# Altium project ESP-MONITOR.PrjPCB (part 1 of 2)
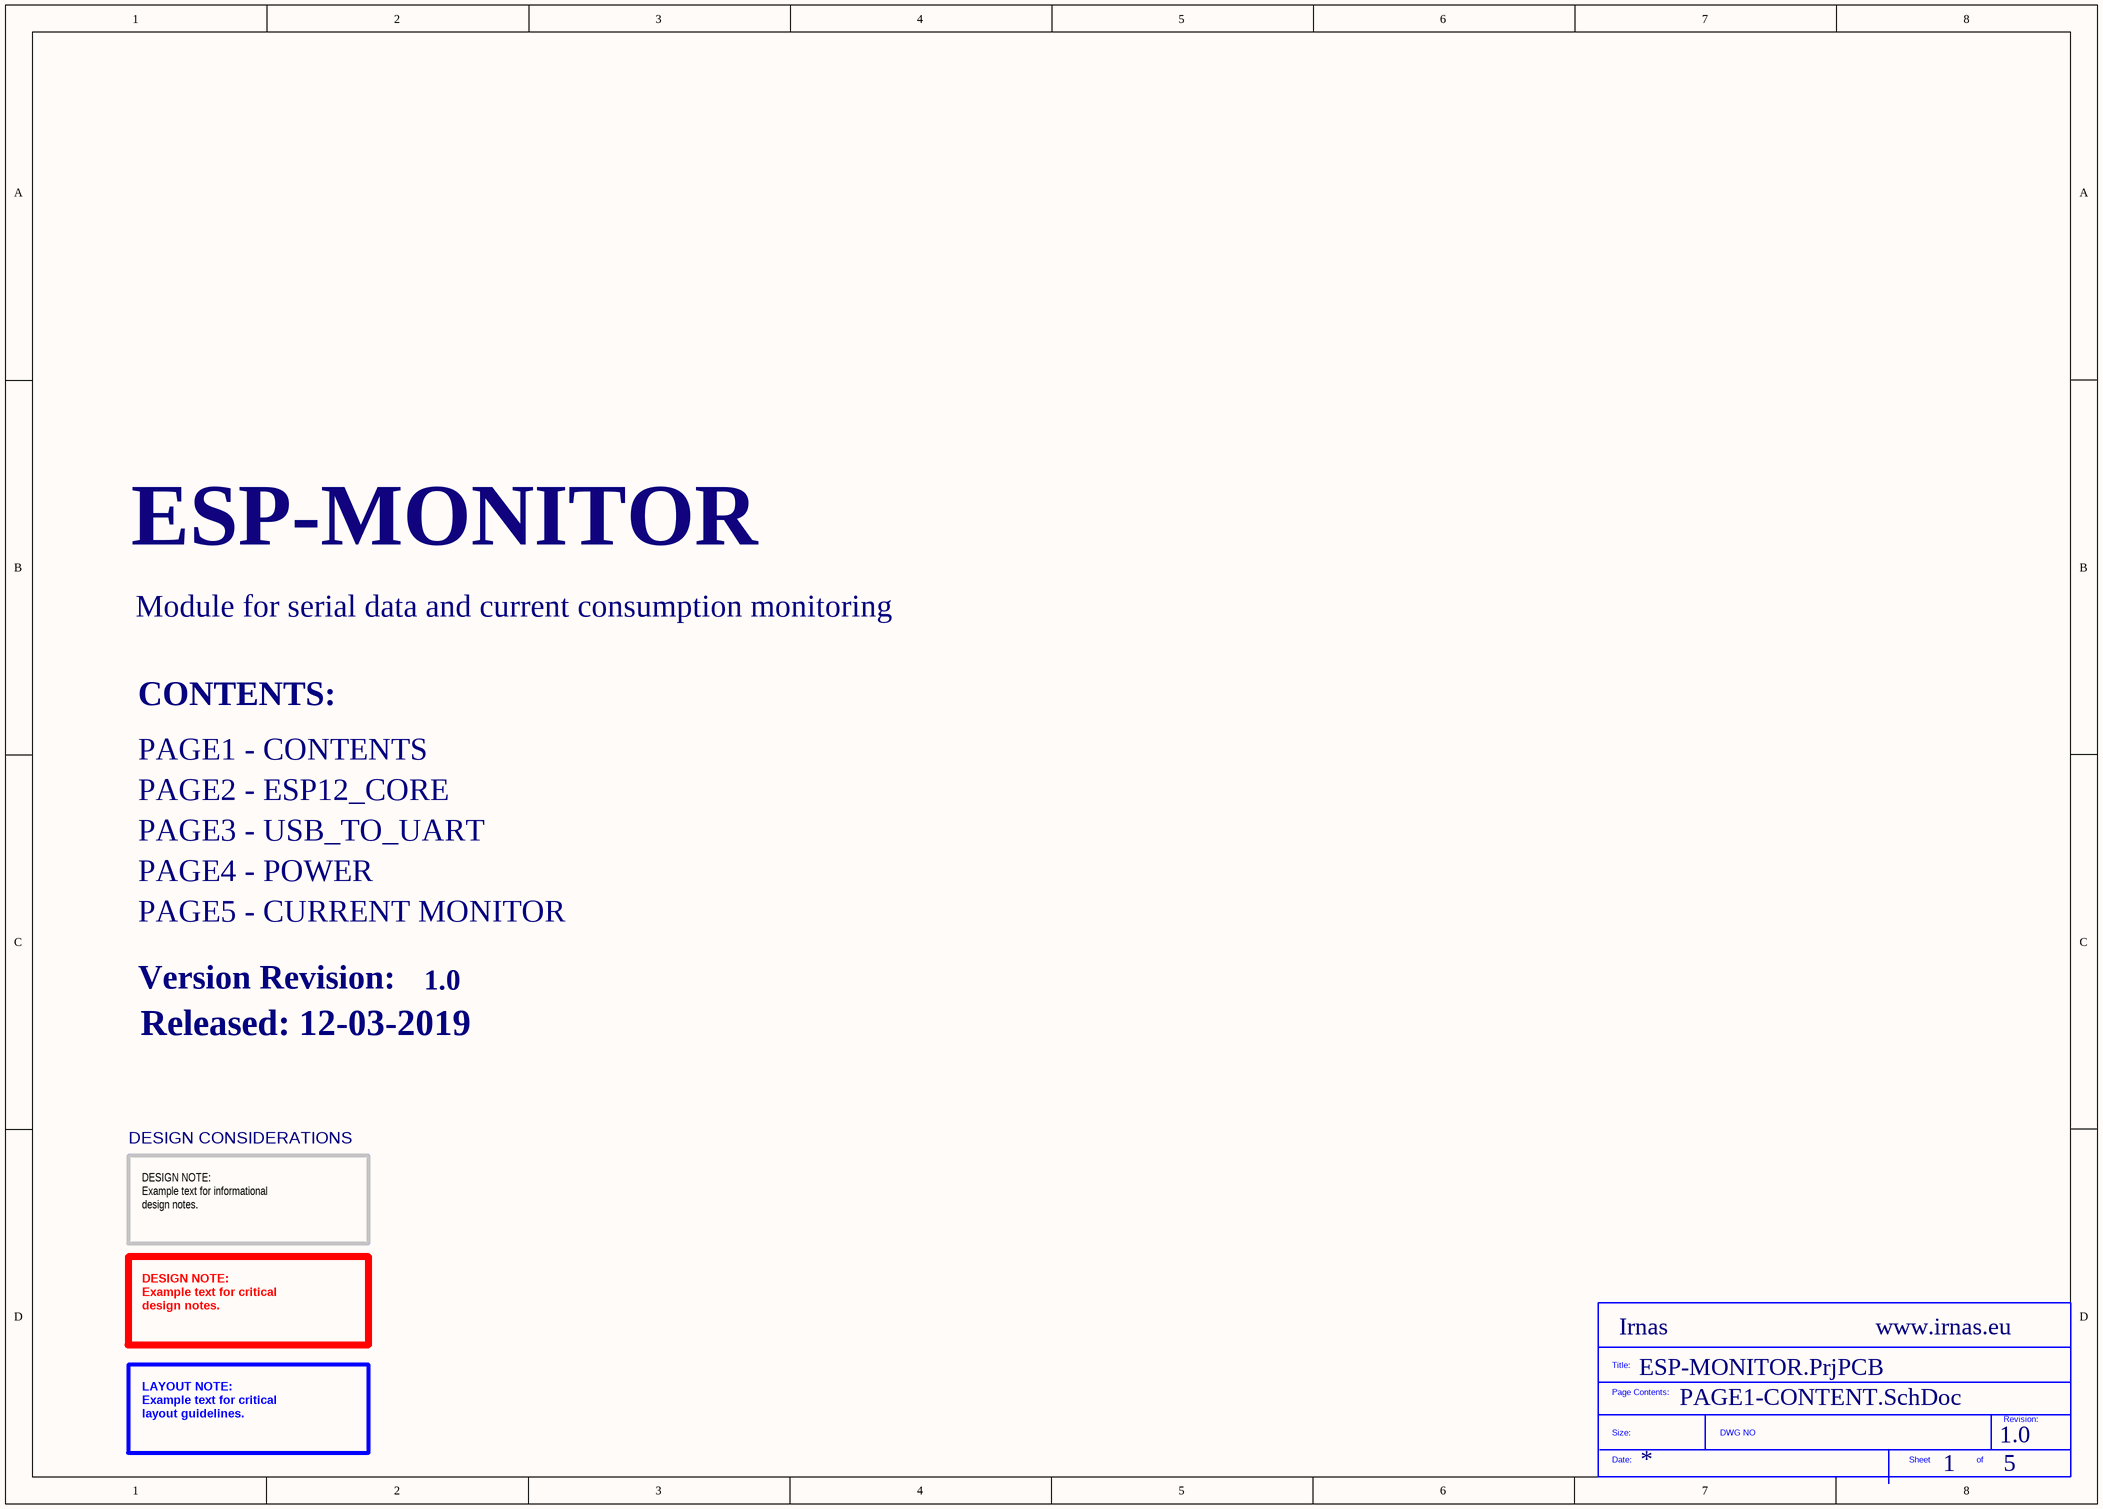
[diagram p0: PAGE1-CONTENT.SchDoc]
Company: Irnas; ProjectTitle: ESP-MONITOR; Version: 1.0; website: www.irnas.eu
5 sheets, 76 parts. Net scope: flat (ports and power ports of the same name join across sheets).
Board file: ESP-MONITOR_PCB.PcbDoc
Sheets:
  PAGE1-CONTENT.SchDoc
  PAGE2-ESP12_CORE.SchDoc
  PAGE3-USB_TO_UART.SchDoc
  PAGE4-POWER.SchDoc
  PAGE5-CURRENT_MON.SchDoc

## Sheet PAGE1-CONTENT.SchDoc
size A3; DocumentNumber: 1; SheetNumber: 1; SheetTotal: 5

### Parts
(Parts that share a designator on the sheet are numbered #1, #2 ... from top to bottom, then left to right.)
*?#1  SDTitleBlock  (value not drawn)  (graphical)

### Notes on the sheet
- Module for serial data and current consumption monitoring
- CONTENTS:
- PAGE1 - CONTENTS
- PAGE2 - ESP12_CORE
- PAGE3 - USB_TO_UART
- PAGE4 - POWER
- Version Revision:
- PAGE5 - CURRENT MONITOR
- Released: 12-03-2019
- DESIGN CONSIDERATIONS
- DESIGN NOTE:
  Example text for informational
  design notes.
- DESIGN NOTE:
  Example text for critical
  design notes.
- LAYOUT NOTE:
  Example text for critical
  layout guidelines.
- Title
- Size:
- Date:
- A3
- Number:
- Time:
- Revision:
- Sheet
- of
- File:
- (in symbol SDTitleBlock) Title:; Page Contents:; Revision:; Size:; DWG NO; Date:; Sheet; of

## Sheet PAGE2-ESP12_CORE.SchDoc
size A3; DocumentNumber: 2; SheetNumber: 2; SheetTotal: 5
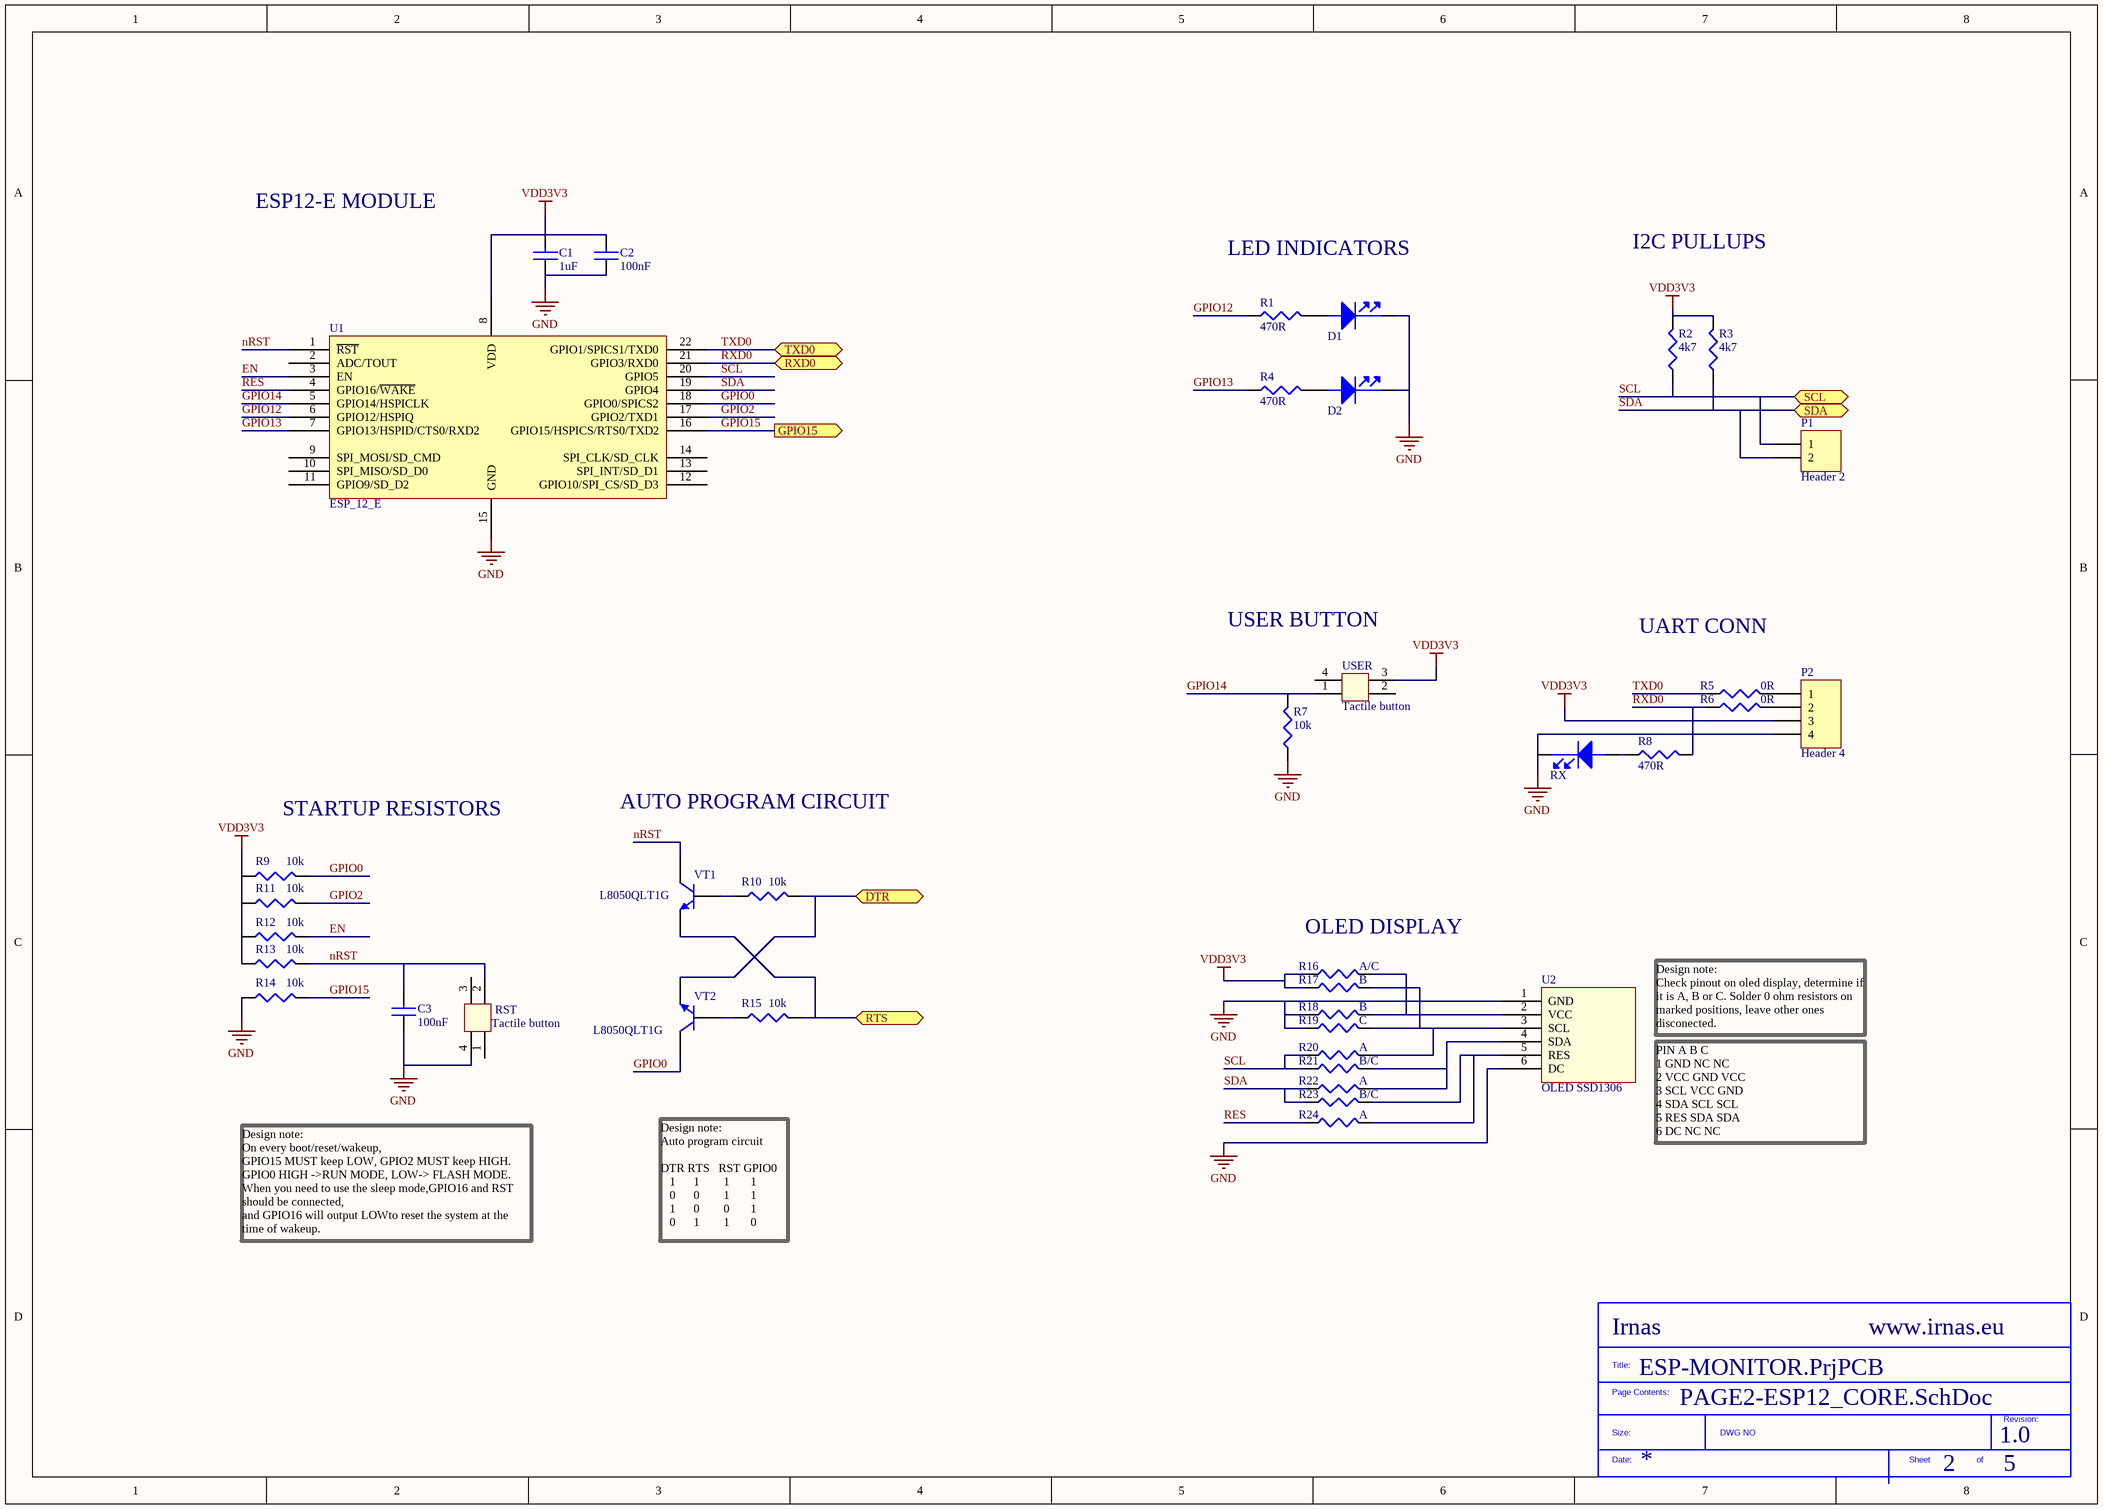
[diagram p1: PAGE2-ESP12_CORE.SchDoc]

### Parts
(Parts that share a designator on the sheet are numbered #1, #2 ... from top to bottom, then left to right.)
*?#2  SDTitleBlock  (value not drawn)  (graphical)
C1  1uF  [CAP0603]
C2  100nF  [CAP0603]
C3  100nF  [CAP0603]
D1  LED RED  [LED0603]  (value not drawn)
D2  LED RED  [LED0603]  (value not drawn)
P1  Header 2  [HDR1X2]  (no BOM)
P2  Header 4  [HDR1X4]  (no BOM)
R1  470R  [RES0603]
R2  4k7  [RES0603]
R3  4k7  [RES0603]
R4  470R  [RES0603]
R5  0R  [RES0603]
R6  0R  [RES0603]
R7  10k  [RES0603]
R8  470R  [RES0603]
R9  10k  [RES0603]
R10  10k  [RES0603]
R11  10k  [RES0603]
R12  10k  [RES0603]
R13  10k  [RES0603]
R14  10k  [RES0603]
R15  10k  [RES0603]
R16  A/C  [RES0603]
R17  B  [RES0603]
R18  B  [RES0603]
R19  C  [RES0603]
R20  A  [RES0603]
R21  B/C  [RES0603]
R22  A  [RES0603]
R23  B/C  [RES0603]
R24  A  [RES0603]
RST  Tactile button  [Tactile button]
RX  LED RED  [LED0603]  (value not drawn)
U1  ESP_12_E  [ESP_12_E]
U2  OLED SSD1306  [OLED SSD1306]
USER  Tactile button  [Tactile button]
VT1  L8050QLT1G  [SMT_TRIODE_NPN]
VT2  L8050QLT1G  [SMT_TRIODE_NPN]

### Ports
DTR (bidir), GPIO15 (out), RTS (bidir), RXD0 (bidir), SCL (bidir), SDA (bidir), TXD0 (bidir)

### Nets
GND: C1.1 C2.1 C3.1 D1.1(cathode) D2.1(cathode) P2.4 R7.1 R14.1 R18.1 R19.1 RST.4 RX.1(cathode) U1.15(GND) U2.1(GND) U2.6(DC)
VDD3V3: C1.2 C2.2 P2.3 R2.2 R3.2 R9.1 R11.1 R12.1 R13.1 R16.1 R17.1 U1.8(VDD) USER.3
EN: R12.2 U1.3(EN)
GPIO0: R9.2 U1.18(GPIO0/SPICS2) VT2.3(C)
GPIO2: R11.2 U1.17(GPIO2/TXD1)
GPIO12: R1.1 U1.6(GPIO12/HSPIQ)
GPIO13: R4.1 U1.7(GPIO13/HSPID/CTS0/RXD2)
GPIO14: R7.2 U1.5(GPIO14/HSPICLK) USER.1
GPIO15: R14.2 U1.16(GPIO15/HSPICS/RTS0/TXD2) ; port GPIO15
nRST: C3.2 R13.2 RST.2 U1.1(~{RST}) VT1.3(C)
RES: R24.1 U1.4(GPIO16/~{WAKE})
RXD0: R6.1 R8.2 U1.21(GPIO3/RXD0) ; port RXD0
SCL: P1.1 R2.1 R20.1 R21.1 U1.20(GPIO5) ; port SCL
SDA: P1.2 R3.1 R22.1 R23.1 U1.19(GPIO4) ; port SDA
TXD0: R5.1 U1.22(GPIO1/SPICS1/TXD0) ; port TXD0
NetD1_2: D1.2(ANODE) R1.2
NetD2_2: D2.2(ANODE) R4.2
NetP2_1: P2.1 R5.2
NetP2_2: P2.2 R6.2
NetR8_1: R8.1 RX.2(ANODE)
NetR10_1: R10.1 VT1.1(B)
NetR10_2: R10.2 VT2.2(E) ; port DTR
NetR15_1: R15.1 VT2.1(B)
NetR15_2: R15.2 VT1.2(E) ; port RTS
NetR16_2: R16.2 R18.2 U2.2(VCC)
NetR17_2: R17.2 R19.2 R20.2 U2.3(SCL)
NetR21_2: R21.2 R22.2 U2.4(SDA)
NetR23_2: R23.2 R24.2 U2.5(RES)

Not connected (* = marked no-connect by the designer): RST 1 3; U1 2(ADC/TOUT) 9(SPI_MOSI/SD_CMD) 10(SPI_MISO/SD_D0) 11(GPIO9/SD_D2) 12(GPIO10/SPI_CS/SD_D3) 13(SPI_INT/SD_D1) 14(SPI_CLK/SD_CLK); USER 2 4

### Notes on the sheet
- ESP12-E MODULE
- LED INDICATORS
- I2C PULLUPS
- USER BUTTON
- UART CONN
- STARTUP RESISTORS
- AUTO PROGRAM CIRCUIT
- OLED DISPLAY
- Design note:
  Check pinout on oled display, determine if it is A, B or C. Solder 0 ohm resistors on marked positions, leave other ones disconected.
- PIN	A	B	C
  1	GND	NC	NC
  2	VCC	GND	VCC
  3	SCL	VCC	GND
  4	SDA	SCL	SCL
  5	RES	SDA	SDA
  6	DC	NC	NC
- Design note:
  On every boot/reset/wakeup,
  GPIO15 MUST keep LOW, GPIO2 MUST keep HIGH.
  GPIO0 HIGH ->RUN MODE, LOW-> FLASH MODE.
  When you need to use the sleep mode,GPIO16 and RST should be connected,
  and GPIO16 will output LOWto reset the system at the time of wakeup.
- Design note:
  Auto program circuit
  DTR RTS   RST GPIO0
  1      1        1       1
  0      0        1       1
  1      0        0       1
  0      1        1       0
- Title
- Size:
- Date:
- A3
- Number:
- Time:
- Revision:
- Sheet
- of
- File:
- (in symbol SDTitleBlock) Title:; Page Contents:; Revision:; Size:; DWG NO; Date:; Sheet; of

### Library data of the parts
C1 = 1uF: MURATA - GRM188R61H105KAALD - CAP, MLCC, X5R, 1UF, 50V, 0603; Ceramic Capacitor Case: 0603 [1608 Metric]; Capacitance: 1; Voltage Rating: 50; Capacitance Tolerance: ± 10%; Dielectric Characteristic: X5; Product Range: GRM Series; SVHC: No SVHC (17-Dec-2015); Capacitor Terminals: SMD<!--FANDB--><div class="features-and-benefits-container"><div class="features-and-benefits-description"><span class="features-benefits-value">The Murata GRM series capacitors are Multilayer Ceramic Chip Capacitors (MLCC) used for general purpose applications. These MLCC capacitors are classified into temperature compensating and high dielectric constant types depending on the change in electrostatic capacitance due to change in temperature. The temperature compensating capacitors feature a small rate of change in electrostatic capacitance as the temperature changes and are used for applications such as filters and high frequency circuit matching. The high dielectric constant capacitors use materials with a high dielectric constant and feature a large electrostatic capacitance. Typical applications are power supply decoupling and smoothing circuits.</span></div><div class="features-and-benefits-list"><ul class="features-and-benefits-list-list"><li class="features-and-benefits-list-item">Large capacity and small size in a multilayer structure</li><li class="features-and-benefits-list-item">Capacitance value ranging from 0.1pF to 220?F</li><li class="features-and-benefits-list-item">Tin plated external electrodes, excellent solderability</li><li class="features-and-benefits-list-item">Provides good high frequency characteristics</li><li class="features-and-benefits-list-item">Excellent pulse response</li><li class="features-and-benefits-list-item">High reliability</li><li class="features-and-benefits-list-item">Capacitor size varies from 0.4×0.2mm to 5.7×5.0mm</li><li class="features-and-benefits-list-item">Rated voltage of 2.5VDC to 3.15; Supplier 1: Farnell; Manufacturer: MURATA; Manufacturer Part Number: GRM188R61H105KAALD; RoHS: YES; Stock 1: 62682; Pricing 1: 10=0.093, 100=0.062, 500=0.0507, 1000=0.0465, 2000=0.0429, 4000=0.0399, 20000=0.0372, 40000=0.0365 (GBP); Packaging: Cut Tape; Operating Temperature Min: -55; Operating Temperature Max: 85; Automotive Qualification Standard: -; MSL: -; Capacitance Tolerance ±: ± 10%; ComponentLink1URL: http://www.farnell.com/datasheets/2048611.pdf; ComponentLink1Description: http://www.farnell.com/datasheets/2048611.pdf; Supplier Part Number 1: 1845736
C2 C3 = 100nF: MURATA - GRM188R71C104KA01J - CAP, MLCC, X7R, 0.1UF, 16V, 0603; Ceramic Capacitor Case: 0603 [1608 Metric]; Capacitance: 0.1; Voltage Rating: 16; Capacitance Tolerance: ± 10%; Dielectric Characteristic: X7; Product Range: GRM Series; SVHC: No SVHC (20-Jun-2016; Supplier 1: Farnell; Manufacturer: MURATA; Manufacturer Part Number: GRM188R71C104KA01J; RoHS: YES; Stock 1: 18297; Pricing 1: 10=0.0145, 100=0.0126, 500=0.0081, 2500=0.0059, 5000=0.0052, 10000=0.0046, 50000=0.0036, 100000=0.0035 (GBP); Packaging: Cut Tape; Operating Temperature Min: -55; Operating Temperature Max: 125; Automotive Qualification Standard: -; MSL: MSL 1 - Unlimited; ComponentLink1URL: http://www.farnell.com/datasheets/2189124.pdf; ComponentLink1Description: http://www.farnell.com/datasheets/2189124.pdf; Supplier Part Number 1: 2688519
D1 D2 RX = LED RED: BROADCOM LIMITED - HSMS-C190 - LED, RED, 10MCD, 626NM; LED Mounting: SMD; Forward Current If: 20; Forward Voltage: 2.1; Wavelength Typ: 626; Luminous Intensity: 10; Viewing Angle: 170°; Lens Shape: Rectangular; SVHC: No SVHC (17-Dec-2015)<!--FANDB--><div class="features-and-benefits-container"><div class="features-and-benefits-description"><span class="features-benefits-value">The HSMS-C190 is a HER SMD Chip LED with untinted/diffused lens, made of GaP. It is designed in an industry standard package 1.6 x 0.8mm footprint with 0.8mm profile. It is compatible with IR reflow solder processes. The small size and wide viewing angle make this LED prime choices for backlighting applications and front panel illumination especially where space is a premium.</span></div><div class="features-and-benefits-list"><ul class="features-and-benefits-list-list"><li class="features-and-benefits-list-item">Small size</li><li class="features-and-benefits-list-item">Industry standard footprint</li><li class="features-and-benefits-list-item">Compatible with IR solder</li><li class="features-and-benefits-list-item">Diffused optics</li><li class="features-and-benefits-list-item">-40 to 85; Supplier 1: Farnell; Manufacturer: BROADCOM LIMITED; Manufacturer Part Number: HSMS-C190; RoHS: YES; Stock 1: 7534; Pricing 1: 1=0.361, 10=0.256, 50=0.235, 100=0.106, 200=0.101 (GBP); LED Colour: Red; Bulb Size: -; Packaging: Cut Tape; Product Range: -; Automotive Qualification Standard: -; MSL: -; ComponentLink1URL: http://www.farnell.com/datasheets/313031.pdf; ComponentLink1Description: http://www.farnell.com/datasheets/313031.pdf; ComponentLink2URL: http://www.farnell.com/datasheets/1681524.pdf; ComponentLink2Description: http://www.farnell.com/datasheets/1681524.pdf; ComponentLink3URL: http://www.farnell.com/datasheets/2165483.pdf; ComponentLink3Description: http://www.farnell.com/datasheets/2165483.pdf; Supplier Part Number 1: 2497356
P1 = Header 2: Header, 2-Pin; LatestRevisionDate: 17-Jul-2002; LatestRevisionNote: Re-released for DXP Platform.; Publisher: Altium Limited
P2 = Header 4: Header, 4-Pin; LatestRevisionDate: 17-Jul-2002; LatestRevisionNote: Re-released for DXP Platform.; Publisher: Altium Limited
R1 R4 R8 = 470R: MULTICOMP - MCMR06X471 JTL - RES, CERAMIC, 470R, 5%, 0.1W, 0603; Supplier 1: Farnell; Manufacturer: MULTICOMP; Manufacturer Part Number: MCMR06X471 JTL; RoHS: Y-EX; Stock 1: 3786; Pricing 1: 10=0.0089, 100=0.0076, 500=0.0063, 1000=0.0049, 2500=0.0033, 5000=0.0024, 25000=0.0016, 50000=0.0013 (GBP); ComponentLink1URL: http://www.farnell.com/datasheets/1716707.pdf; ComponentLink1Description: http://www.farnell.com/datasheets/1716707.pdf; Supplier Part Number 1: 2073513
R2 R3 = 4k7: MULTICOMP - MCMR06X4701FTL - RES, CERAMIC, 4K7, 1%, 0.1W, 0603; Resistance: 4.7; Voltage Rating: 75; Resistor Case Style: 0603 [1608 Metric]; Power Rating: 100; Product Range: MCMR Series; Temperature Coefficient: ± 100; SVHC: No SVHC (12-Jan-2017)<!--FANDB--><div class="features-and-benefits-container"><div class="features-and-benefits-description"><span class="features-benefits-value">The Multicomp MCMR series resistors are automotive grade, anti sulphured thick film chip resistor. The resistance range includes E24 and E96 decade values from 1ohm to 10Mohm. These resistors are constructed on top of a high grade ceramic body.</span></div><div class="features-and-benefits-list"><ul class="features-and-benefits-list-list"><li class="features-and-benefits-list-item">EIA 0402, 0603, 0805, 1206 chip sizes available</li><li class="features-and-benefits-list-item">High reliability and stability</li><li class="features-and-benefits-list-item">Automotive grade AEC-Q200 compliant</li><li class="features-and-benefits-list-item">Complaint with (IEC 60068-1) 55/155/56 climatic category</li><li class="features-and-benefits-list-item">Maximum operation voltage of 50V, 75V, 150V and 200V</li><li class="features-and-benefits-list-item">Power rating of 62.5mW, 100mW, 125mW and 250mW</li><li class="features-and-benefits-list-item">Available in ±1% and ±5% tolerance</li><li class="features-and-benefits-list-item">Temperature coefficient (TCR) of +200ppm/°C, +100ppm/°C and -200ppm/°C to +400ppm/°C</li><li class="features-and-benefits-list-item">Operating temperature range -55°C to 155; Supplier 1: Farnell; Manufacturer: MULTICOMP; Manufacturer Part Number: MCMR06X4701FTL; RoHS: Y-EX; Stock 1: 218618; Pricing 1: 10=0.0085, 100=0.0051, 500=0.0036, 1000=0.0028, 2500=0.0023 (GBP); Resistance Tolerance: ± 1%; Packaging: Cut Tape; Resistor Element Material: Ceramic; Automotive Qualification Standard: -; ComponentLink1URL: http://www.farnell.com/datasheets/1716707.pdf; ComponentLink1Description: http://www.farnell.com/datasheets/1716707.pdf; Supplier Part Number 1: 2073509
R5 R6 R16-R24 = 0R: BOURNS - CR0603-J/-000ELF - RES, THICK FILM, 0R, 5%, 0.1W, 0603; Resistance: 0; Voltage Rating: 50; Resistor Case Style: 0603 [1608 Metric]; Power Rating: 100; Product Range: CR Series; SVHC: No SVHC (17-Dec-2015); Resistor Mounting: Surface Mount Device<!--FANDB--><div class="features-and-benefits-container"><div class="features-and-benefits-description"><span class="features-benefits-value">The Bourns CR series are standard thick film chip resistors. These resistors provide flexibility of performance, space saving and low cost. The Resistance range includes E96 and E24 decade values from 1ohm to 10Mohm.</span></div><div class="features-and-benefits-list"><ul class="features-and-benefits-list-list"><li class="features-and-benefits-list-item">0201, 0402, 0603, 0805, 1206, 1210, 2010, 2512 standard case sizes available</li><li class="features-and-benefits-list-item">±1% and ±5% tolerance</li><li class="features-and-benefits-list-item">±100ppm/°C, ±200ppm/°C and ±250ppm/°C TCR values available</li><li class="features-and-benefits-list-item">Power rating selectable for 50mW, 63mW, 0.1W, 0.125W, 0.25W, 0.5W and 1W based on ordering</li><li class="features-and-benefits-list-item">Jumpers are available for all size</li><li class="features-and-benefits-list-item">3 layer termination process with nickel barrier prevents leaching & provides excellent solderability</li><li class="features-and-benefits-list-item">Suitable for all type of soldering processes</li><li class="features-and-benefits-list-item">Tight dimensional tolerances</li><li class="features-and-benefits-list-item">Maximum working voltage depends on case size</li><li class="features-and-benefits-list-item">Operating temperature of -55°C to +125°C(CR0201) and -55°C to +155; Supplier 1: Farnell; Manufacturer: BOURNS; Manufacturer Part Number: CR0603-J/-000ELF; RoHS: YES; Stock 1: 58200; Pricing 1: 10=0.0146, 250=0.0097, 1000=0.0073, 5000=0.0049, 12500=0.0042 (GBP); Resistance Tolerance: ± 5%; Packaging: Cut Tape; Resistor Element Material: Thick Film; Temperature Coefficient: -; Automotive Qualification Standard: -; MSL: MSL 1 - Unlimited; ComponentLink1URL: http://www.bourns.com/engineering/CHPREZTR/cr0603.stp; ComponentLink1Description: http://www.bourns.com/engineering/CHPREZTR/cr0603.stp; ComponentLink2URL: http://www.farnell.com/datasheets/2178762.pdf; ComponentLink2Description: http://www.farnell.com/datasheets/2178762.pdf; Supplier Part Number 1: 2008343
R7 R9-R15 = 10k: MULTICOMP - MCMR06X103 JTL - RES, CERAMIC, 10K, 5%, 0.1W, 0603; Resistance: 10; Voltage Rating: 75; Resistor Case Style: 0603 [1608 Metric]; Power Rating: 100; Product Range: MCMR Series; Temperature Coefficient: ± 100; Automotive Qualification Standard: -<!--FANDB--><div class="features-and-benefits-container"><div class="features-and-benefits-description"><span class="features-benefits-value">The Multicomp MCMR series resistors are automotive grade, anti sulphured thick film chip resistor. The resistance range includes E24 and E96 decade values from 1ohm to 10Mohm. These resistors are constructed on top of a high grade ceramic body.</span></div><div class="features-and-benefits-list"><ul class="features-and-benefits-list-list"><li class="features-and-benefits-list-item">EIA 0402, 0603, 0805, 1206 chip sizes available</li><li class="features-and-benefits-list-item">High reliability and stability</li><li class="features-and-benefits-list-item">Automotive grade AEC-Q200 compliant</li><li class="features-and-benefits-list-item">Complaint with (IEC 60068-1) 55/155/56 climatic category</li><li class="features-and-benefits-list-item">Maximum operation voltage of 50V, 75V, 150V and 200V</li><li class="features-and-benefits-list-item">Power rating of 62.5mW, 100mW, 125mW and 250mW</li><li class="features-and-benefits-list-item">Available in ±1% and ±5% tolerance</li><li class="features-and-benefits-list-item">Temperature coefficient (TCR) of +200ppm/°C, +100ppm/°C and -200ppm/°C to +400ppm/°C</li><li class="features-and-benefits-list-item">Operating temperature range -55°C to 155; Supplier 1: Farnell; Manufacturer: MULTICOMP; Manufacturer Part Number: MCMR06X103 JTL; RoHS: Y-EX; Stock 1: 19791; Pricing 1: 10=0.0087, 100=0.0074, 500=0.0061, 1000=0.0048, 2500=0.0032, 5000=0.0024, 25000=0.0016, 50000=0.0013 (GBP); Resistance Tolerance: ± 5%; Packaging: Cut Tape; Resistor Element Material: Ceramic; ComponentLink1URL: http://www.farnell.com/datasheets/1716707.pdf; ComponentLink1Description: http://www.farnell.com/datasheets/1716707.pdf; Supplier Part Number 1: 2073356
RST USER = KMR221NGLFS: SWITCH TACTILE SPST-NO 0.05A 32V; Manufacturer: ITT C&K; Pole Throw Configuration: SPST; Mechanical Life: 200000 Cycles; Switch Configuration: N.O.; Illumination Type: N/R; Ground Terminal: No; Body Orientation: Straight; Actuator Length: 0.5 mm; Operating Force: 2 N; Actuator Style: Round Button; Dielectric Strength: >=250 Vrms; Minimum Insulation Resistance: >=1000 MOhm; Contact Rating @ Voltage: 1 A; Supplier 1: C&K Components; Manufacturer Part Number: KMR221NGLFS; Stock 1: 5345; Pricing 1: 10=0.278, 500=0.264, 1000=0.208, 5000=0.204, 10000=0.2 (GBP); Part No: KMR221NGLFS; RoHS: Yes; Supplier Standard Pack: 7,000; Type: Micro-Miniature; Maximum AC Voltage Rating: N/A; Family: KMR 2; Contact Material: Silver; Actuator Color: N/A; Maximum DC Voltage Rating: 32 V; Seal Description: N/A; Packaging: Tape and Reel; Contact Plating: Silver; Electrical Life: N/A; Housing Material: N/A; Product Weight: N/A; Base Material: N/A; Mounting: Surface Mount,Gull Wing; Seal Location: N/A; Operating Temperature: -40 to 85 C; Dimension: 2.8 x 4.6 x 1.9 mm; HTS: 8536501199; ECCN: EAR99; ComponentLink1URL: https://datasheet.ciiva.com/16443/kmr221nglfs-16443038.pdf; ComponentLink1Description: https://datasheet.ciiva.com/16443/kmr221nglfs-16443038.pdf; ComponentLink2URL: https://datasheet.ciiva.com/2900/kmr2-9aug12-2900169.pdf; ComponentLink2Description: https://datasheet.ciiva.com/2900/kmr2-9aug12-2900169.pdf; ComponentLink3URL: https://datasheet.ciiva.com/2900/kmr2-9aug12-2900170.pdf; ComponentLink3Description: https://datasheet.ciiva.com/2900/kmr2-9aug12-2900170.pdf; ComponentLink4URL: https://datasheet.ciiva.com/16695/kmr2-9aug12-16695914.pdf; ComponentLink4Description: https://datasheet.ciiva.com/16695/kmr2-9aug12-16695914.pdf; ComponentLink5URL: https://datasheet.ciiva.com/2900/kmr2-9aug12-2900171.pdf; ComponentLink5Description: https://datasheet.ciiva.com/2900/kmr2-9aug12-2900171.pdf; Supplier Part Number 1: 2845727
U1 = ESP_12_E: ESP-12 Wi-Fi Module by AI-Thinker; IC: ESP8266-EX; Vendor: Ai-thinker
VT1 VT2 = SMT_TRIODE_NPN: Surface mount NPN transistor, package SOT-23

## Sheet PAGE3-USB_TO_UART.SchDoc
size A3; DocumentNumber: 3; SheetNumber: 3; SheetTotal: 5
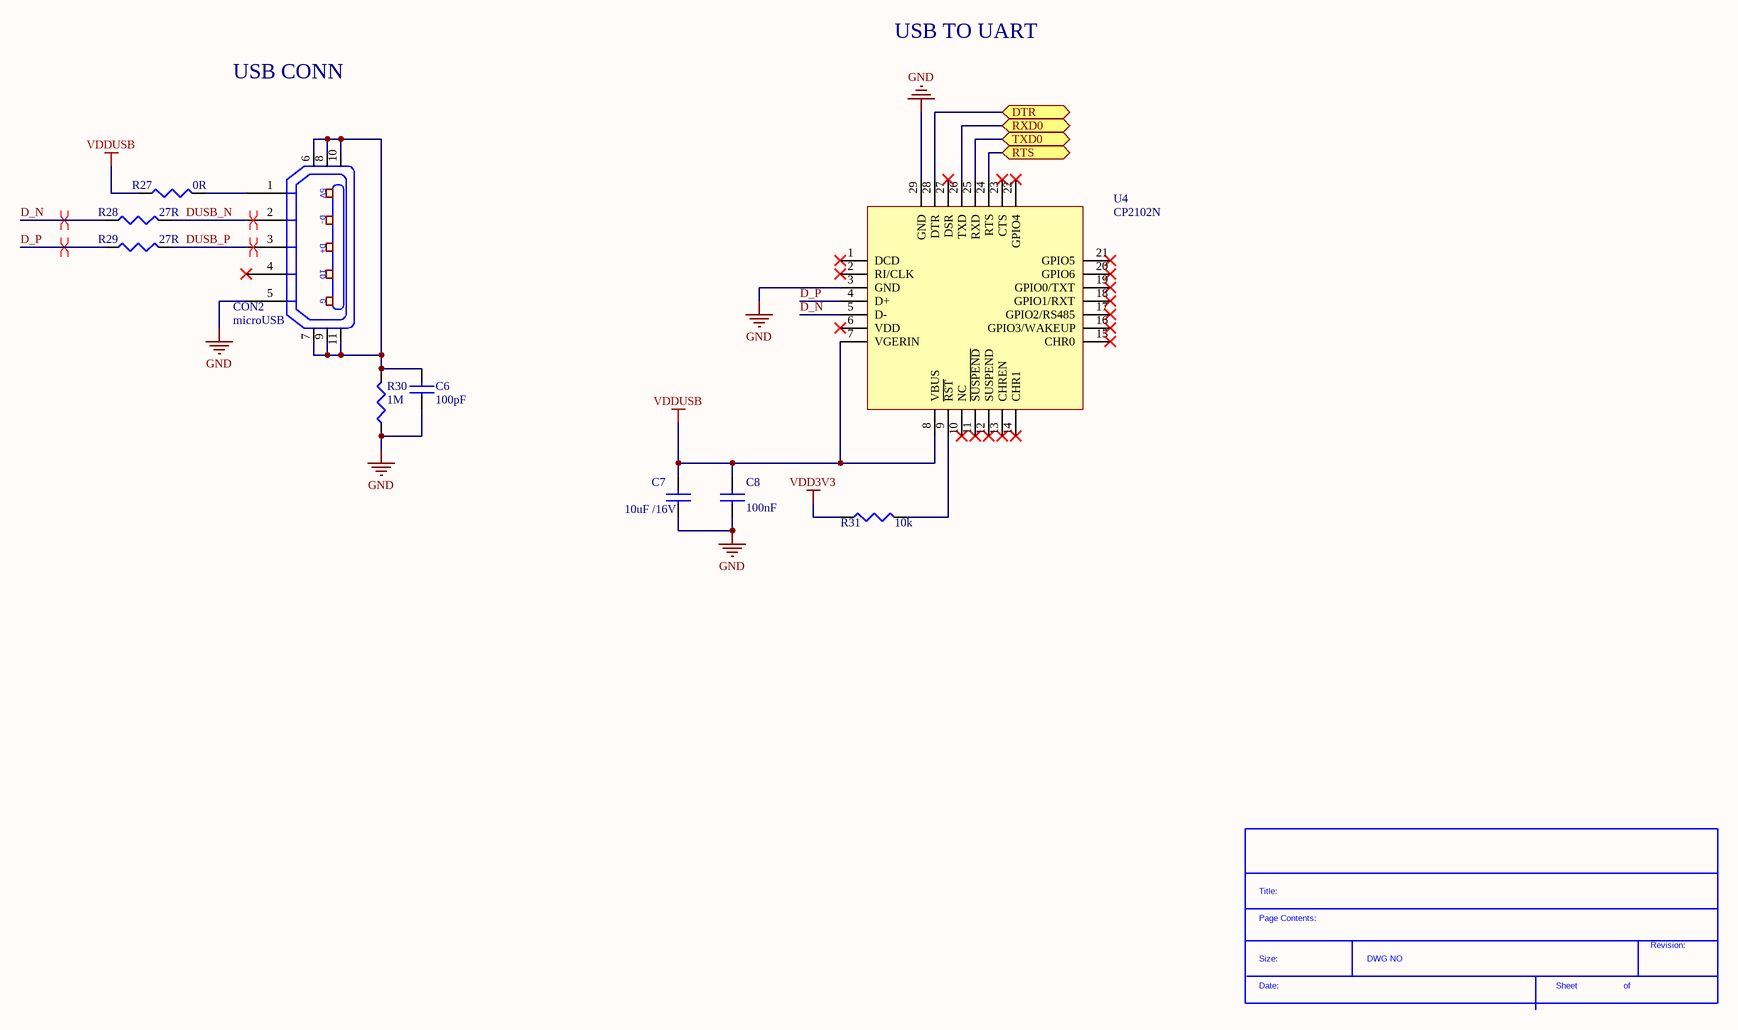
[diagram p2: PAGE3-USB_TO_UART.SchDoc]

### Parts
(Parts that share a designator on the sheet are numbered #1, #2 ... from top to bottom, then left to right.)
*?#3  SDTitleBlock  (value not drawn)  (graphical)
C6  100pF  [CAP0603]
C7  10uF /16V  [CAP0805]
C8  100nF  [CAP0603]
CON2  microUSB  [microUSB-CHINA]  (no BOM)
R27  0R  [RES0603]
R28  27R  [RES0603]
R29  27R  [RES0603]
R30  1M  [RES0603]
R31  10k  [RES0603]
U4  CP2102N  [QFN50P500X500X80_HS-29N]

### Ports
DTR (bidir), RTS (bidir), RXD0 (bidir), TXD0 (bidir)

### Nets
GND: C6.1 C7.1 C8.1 CON2.5(P5) R30.1 U4.3(GND) U4.29(GND)
VDD3V3: R31.1
VDDUSB: C7.2 C8.2 R27.1 U4.7(VGERIN) U4.8(VBUS)
D_N: R28.1 U4.5(D-)
D_P: R29.1 U4.4(D+)
DUSB_N: CON2.2(P2) R28.2
DUSB_P: CON2.3(P3) R29.2
RXD0: U4.26(TXD) ; port RXD0
TXD0: U4.25(RXD) ; port TXD0
NetC6_2: C6.2 CON2.6 CON2.7 CON2.8 CON2.9 CON2.10 CON2.11 R30.2
NetCON2_1: CON2.1(P1) R27.2
NetR10_2: U4.28(DTR) ; port DTR
NetR15_2: U4.24(RTS) ; port RTS
NetR31_2: R31.2 U4.9(~{RST})

Not connected (* = marked no-connect by the designer): CON2 4(P4)*; U4 1(DCD)* 2(RI/CLK)* 6(VDD)* 10(NC)* 11(~{SUSPEND})* 12(SUSPEND)* 13(CHREN)* 14(CHR1)* 15(CHR0)* 16(GPIO3/WAKEUP)* 17(GPIO2/RS485)* 18(GPIO1/RXT)* 19(GPIO0/TXT)* 20(GPIO6)* 21(GPIO5)* 22(GPIO4)* 23(CTS)* 27(DSR)*

### Layout directives
differential pair: D_N, D_P, DUSB_N, DUSB_P

### Notes on the sheet
- USB TO UART
- USB CONN
- Title
- Size:
- Date:
- A3
- Number:
- Time:
- Revision:
- Sheet
- of
- File:
- (in symbol Micro USB CHINA 1) 5V; D-; D+; ID; G
- (in symbol SDTitleBlock) Title:; Page Contents:; Revision:; Size:; DWG NO; Date:; Sheet; of

### Library data of the parts
C6 = 100pF: MULTICOMP   MCSH18B101K500CT   SMD Multilayer Ceramic Capacitor, MCSH Series, 100 pF,  10%, X7R, 50 V, 0603 [1608 Metric]; Voltage Rating: 50V; Supplier 1: Farnell; Manufacturer: Multicomp; Manufacturer Part Number: MCSH18B101K500CT; Stock 1: 9630; Pricing 1: 10=0.0858, 100=0.0386, 500=0.0266, 1000=0.0203, 2000=0.0176 (EUR); Case/Package: 0603; Case Code (Metric): 1608; Case Code (Imperial): 0603; Min Operating Temperature: -55°C; Max Operating Temperature: 125°C; Packaging: Cut Tape; Capacitance: 100pF; Tolerance: 10%; Dielectric: X7R; Voltage Rating (DC): 50V; REACH SVHC: No SVHC; ComponentLink1URL: https://datasheet.ciiva.com/36858/1825494-36858405.pdf; ComponentLink1Description: https://datasheet.ciiva.com/36858/1825494-36858405.pdf; ComponentLink2URL: https://datasheet.ciiva.com/36855/1825494-36855530.pdf; ComponentLink2Description: https://datasheet.ciiva.com/36855/1825494-36855530.pdf; Supplier Part Number 1: 1856366
C7 = 10uF /16V: TDK - CGA4J1X5R1C106K125AC - CAP, MLCC, X5R, 10UF, 16V, 0805; Supplier 1: Farnell; Manufacturer: TDK; Manufacturer Part Number: CGA4J1X5R1C106K125AC; RoHS: YES; Stock 1: 8974; Pricing 1: 5=0.41, 50=0.146, 250=0.131, 500=0.12, 1000=0.103 (GBP); ComponentLink1URL: http://bcove.me/e1v54mtm; ComponentLink1Description: http://bcove.me/e1v54mtm; ComponentLink2URL: http://www.farnell.com/datasheets/1936565.pdf; ComponentLink2Description: http://www.farnell.com/datasheets/1936565.pdf; ComponentLink3URL: http://www.farnell.com/datasheets/1683658.pdf; ComponentLink3Description: http://www.farnell.com/datasheets/1683658.pdf; Supplier Part Number 1: 2210948RL
C8 = 100nF: as C2 on sheet PAGE2-ESP12_CORE; Supplier 1: Farnell; Manufacturer: MURATA; Manufacturer Part Number: GRM188R71C104KA01J; RoHS: YES; Stock 1: 18297; Pricing 1: 10=0.0145, 100=0.0126, 500=0.0081, 2500=0.0059, 5000=0.0052, 10000=0.0046, 50000=0.0036, 100000=0.0035 (GBP); Packaging: Cut Tape; Operating Temperature Min: -55; Operating Temperature Max: 125; Automotive Qualification Standard: -; MSL: MSL 1 - Unlimited; ComponentLink1URL: http://www.farnell.com/datasheets/2189124.pdf; ComponentLink1Description: http://www.farnell.com/datasheets/2189124.pdf; Supplier Part Number 1: 2688519
CON2 = Micro USB CHINA 1
R27 = 0R: as R5 on sheet PAGE2-ESP12_CORE; Supplier 1: Farnell; Manufacturer: BOURNS; Manufacturer Part Number: CR0603-J/-000ELF; RoHS: YES; Stock 1: 58200; Pricing 1: 10=0.0146, 250=0.0097, 1000=0.0073, 5000=0.0049, 12500=0.0042 (GBP); Resistance Tolerance: ± 5%; Packaging: Cut Tape; Resistor Element Material: Thick Film; Temperature Coefficient: -; Automotive Qualification Standard: -; MSL: MSL 1 - Unlimited; ComponentLink1URL: http://www.bourns.com/engineering/CHPREZTR/cr0603.stp; ComponentLink1Description: http://www.bourns.com/engineering/CHPREZTR/cr0603.stp; ComponentLink2URL: http://www.farnell.com/datasheets/2178762.pdf; ComponentLink2Description: http://www.farnell.com/datasheets/2178762.pdf; Supplier Part Number 1: 2008343
R28 R29 = 27R: MULTICOMP         MCWR06X27R0FTL            Surface Mount Chip Resistor, Thick Film, MCWR Series, 27 ohm, 100 mW,  1%, 50 V; Power Rating: 100mW; Voltage Rating: 50V; Temperature Coefficient: 100ppm/°C; Supplier 1: Farnell; Manufacturer: Multicomp; Manufacturer Part Number: MCWR06X27R0FTL; Stock 1: 0; Mount: Surface Mount; Case/Package: 0603; Case Code (Metric): 1608; Case Code (Imperial): 0603; Packaging: Cut Tape; Resistance: 27R; Tolerance: 1%; Composition: Thick Film; Voltage Rating (DC): 50V; REACH SVHC: Unknown; ComponentLink1URL: https://datasheet.ciiva.com/46436/1849611-46436376.pdf; ComponentLink1Description: https://datasheet.ciiva.com/46436/1849611-46436376.pdf; Supplier Part Number 1: 2447316
R30 = 1M: MULTICOMP - MC0063W060311M - RES, THICK FILM, 1M, 1%, 0.063W, 0603; Resistance: 1; Voltage Rating: 50; Resistor Case Style: 0603 [1608 Metric]; Power Rating: 63; Product Range: MC Series; Temperature Coefficient: ± 100; SVHC: No SVHC (17-Dec-2015); External Depth: 0.45; External Length / Height: 1.6; External Width: 0.8; No. of Pins: 2; Reel Quantity: 5000; Resistor Mounting: Surface Mount Device; Temperature Coeff. +: 100; Voltage Rating V DC: 50V<!--FANDB--><div class="features-and-benefits-container"><div class="features-and-benefits-description"><span class="features-benefits-value">The Multicomp MC series current sense resistors are thick film chip resistors. The resistance range includes E96 and E24 decade values from 1ohm to 10Mohm.</span></div><div class="features-and-benefits-list"><ul class="features-and-benefits-list-list"><li class="features-and-benefits-list-item">EIA 0402, 0603, 0805, 1206 chip sizes available</li><li class="features-and-benefits-list-item">Small size and low weight</li><li class="features-and-benefits-list-item">Suitable for both wave and reflow soldering</li><li class="features-and-benefits-list-item">Reduction of assembly costs</li><li class="features-and-benefits-list-item">Maximum working voltage of 50V(0402, 0603), 150V(0805), 200V(1206)</li><li class="features-and-benefits-list-item">Available in ±1%, ±2% and ±5% tolerance</li><li class="features-and-benefits-list-item">Power rating of 62.5mW, 100mW and 125mW</li><li class="features-and-benefits-list-item">±400ppm/°C(1ohm to 10ohm), ±200ppm/°C(11ohm to 100ohm), ±100; Supplier 1: Farnell; Manufacturer: MULTICOMP; Manufacturer Part Number: MC0063W060311M; RoHS: Y-EX; Stock 1: 333415; Pricing 1: 10=0.0011, 100=0.001, 500=0.0009, 1000=0.0008, 2500=0.0007 (GBP); Resistance Tolerance: ± 1%; Packaging: Cut Tape; Resistor Element Material: Thick Film; Automotive Qualification Standard: -; Operating Temperature Max: 155; Operating Temperature Min: -55; Operating Temperature Range: -55°C to +155; Tape Width: 8; Temperature Coeff. -: 100; Tolerance +: 1%; Tolerance -: 1%; ComponentLink1URL: http://www.farnell.com/datasheets/1788326.pdf; ComponentLink1Description: http://www.farnell.com/datasheets/1788326.pdf; ComponentLink2URL: http://www.farnell.com/cad/1558928.zip; ComponentLink2Description: http://www.farnell.com/cad/1558928.zip; Supplier Part Number 1: 9330410
R31 = 10k: as R7 on sheet PAGE2-ESP12_CORE; Supplier 1: Farnell; Manufacturer: MULTICOMP; Manufacturer Part Number: MCMR06X103 JTL; RoHS: Y-EX; Stock 1: 19791; Pricing 1: 10=0.0087, 100=0.0074, 500=0.0061, 1000=0.0048, 2500=0.0032, 5000=0.0024, 25000=0.0016, 50000=0.0013 (GBP); Resistance Tolerance: ± 5%; Packaging: Cut Tape; Resistor Element Material: Ceramic; ComponentLink1URL: http://www.farnell.com/datasheets/1716707.pdf; ComponentLink1Description: http://www.farnell.com/datasheets/1716707.pdf; Supplier Part Number 1: 2073356
U4 = CP2102N-A01-GQFN28: SILICON LABS         CP2102N-A01-GQFN28             Interface Bridges, USB to UART, 3 V, 3.6 V, QFN, 28 Pins, -40 C                          New; Min Supply Voltage: 3V; Max Supply Voltage: 3.6V; Supplier 1: Farnell; Manufacturer: Silicon Labs; Manufacturer Part Number: CP2102N-A01-GQFN28; Stock 1: 729; Pricing 1: 1=1.31, 10=1.2, 25=1.11, 50=1.09, 100=1.07, 250=1.05, 500=1.03, 1000=1.01 (GBP); Case/Package: QFN; Number of Pins: 28; Min Operating Temperature: -40°C; Max Operating Temperature: 85°C; REACH SVHC: Unknown; Supplier Part Number 1: 2577279; ComponentLink1Description: Datasheet; ComponentLink1URL: https://www.silabs.com/documents/public/data-sheets/cp2102n-datasheet.pdf; ComponentLink2Description: Reference design; ComponentLink2URL: https://download.mikroe.com/documents/add-on-boards/click/usb-uart-3/usb-3-uart-click-schematic-v100.pdf

## Sheet PAGE4-POWER.SchDoc
size A3; DocumentNumber: 4; SheetNumber: 4; SheetTotal: 5
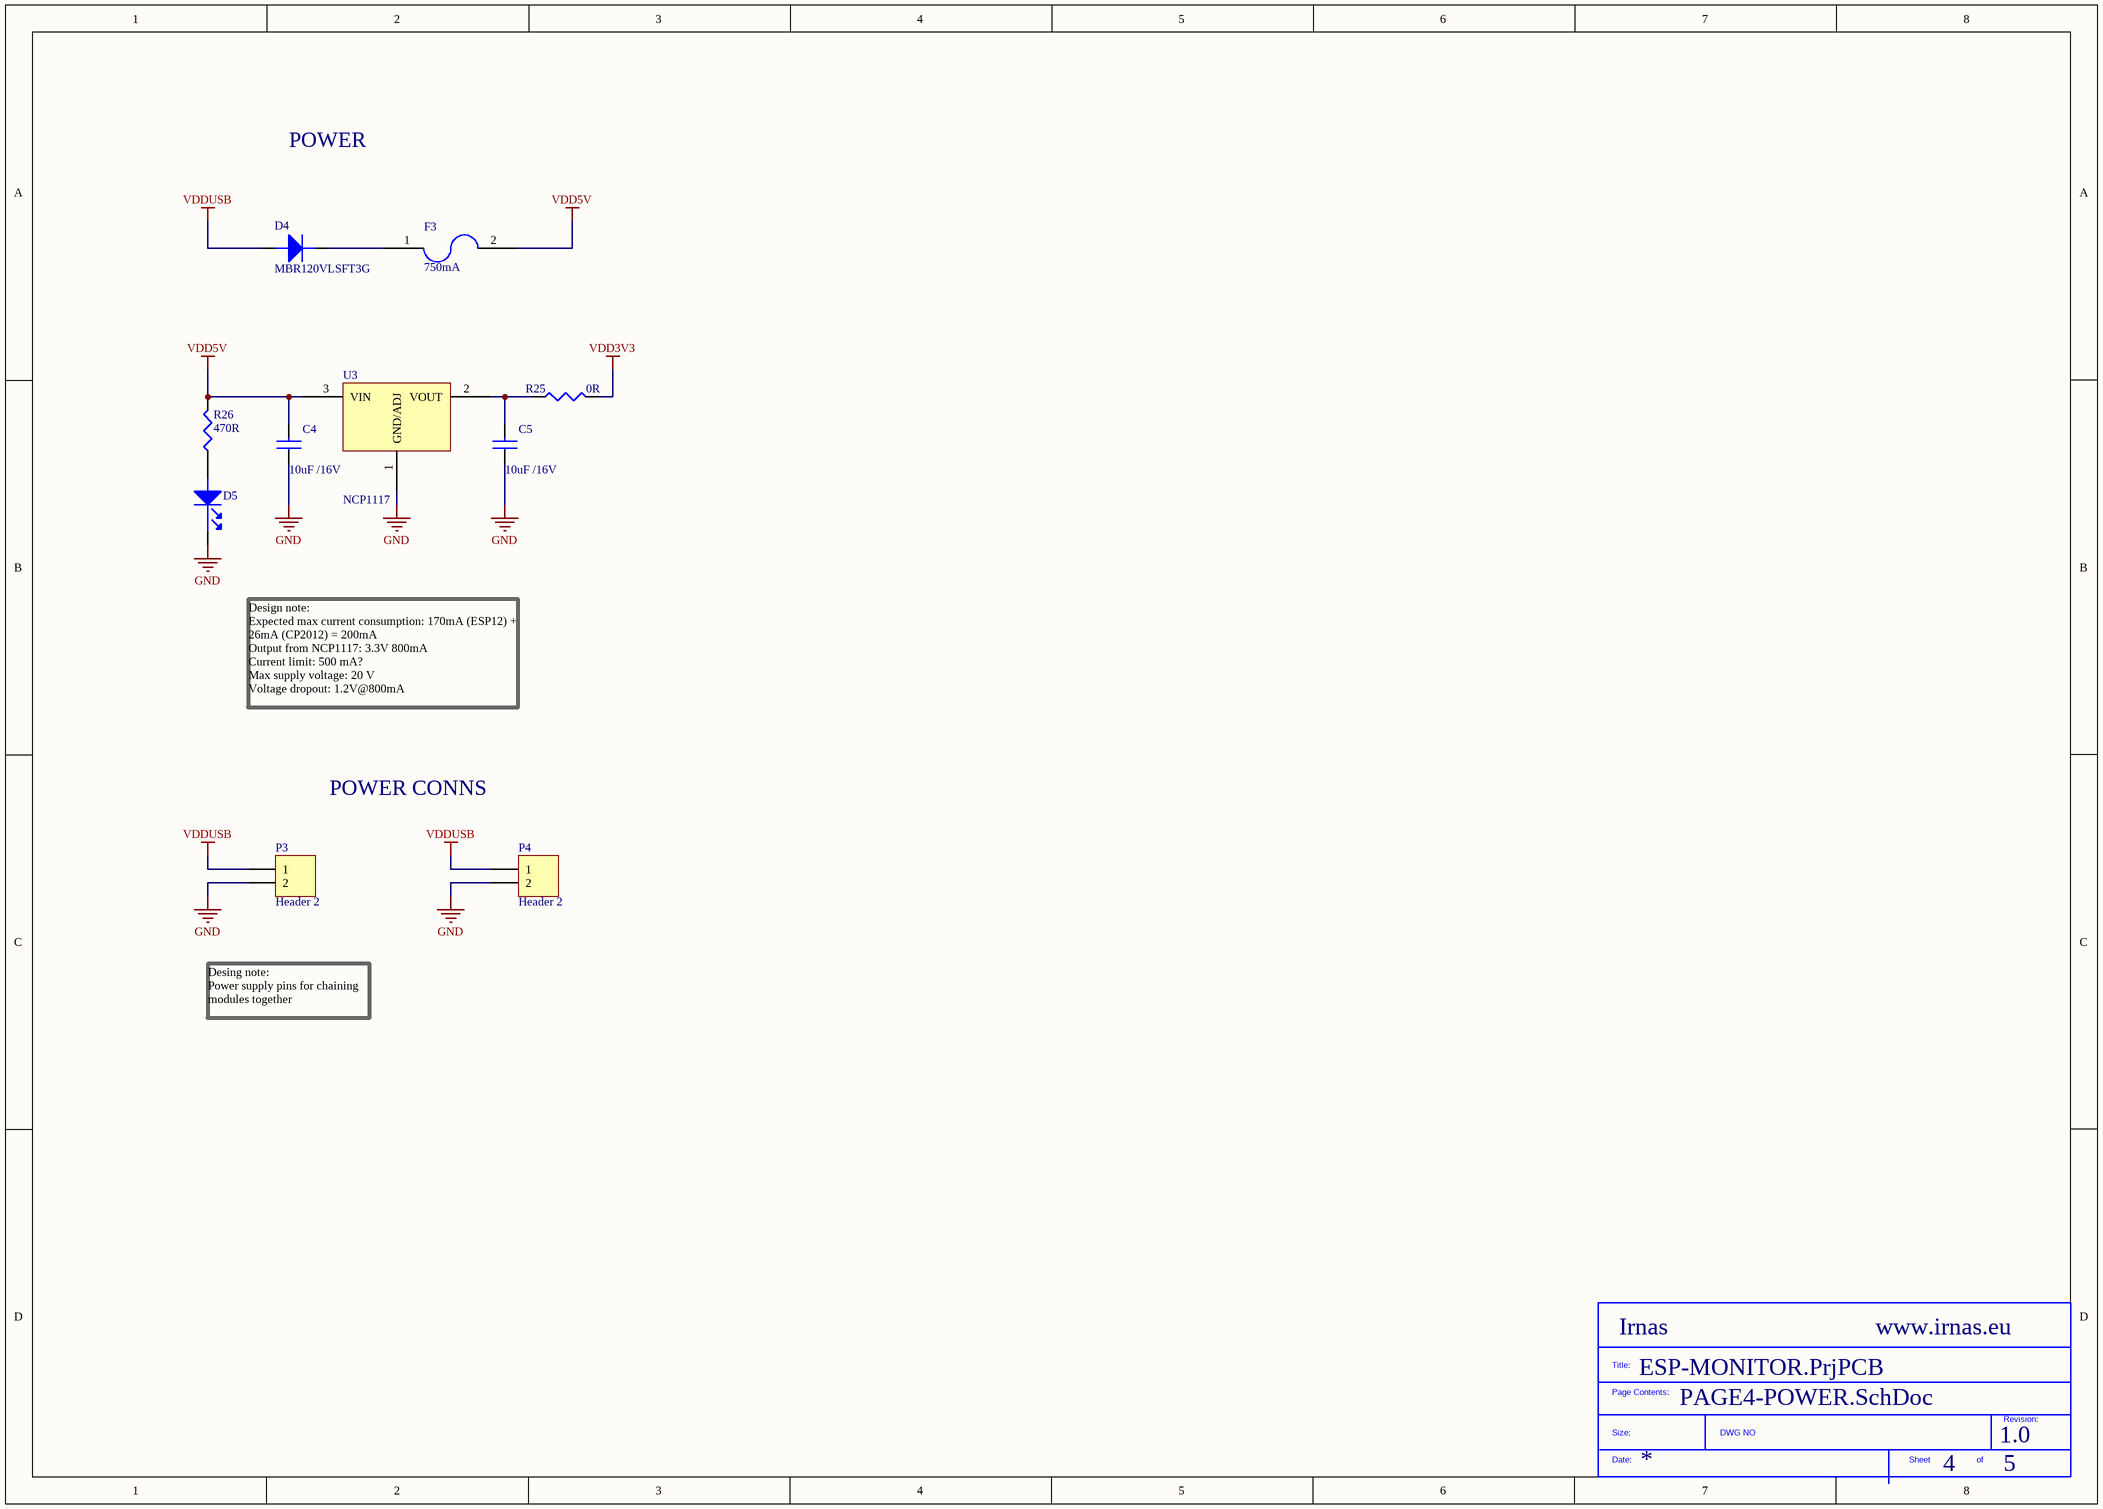
[diagram p3: PAGE4-POWER.SchDoc]

### Parts
(Parts that share a designator on the sheet are numbered #1, #2 ... from top to bottom, then left to right.)
*?#4  SDTitleBlock  (value not drawn)  (graphical)
C4  10uF /16V  [CAP0805]
C5  10uF /16V  [CAP0805]
D4  MBR120VLSFT3G  [SOD123]
D5  LED RED  [LED0603]  (value not drawn)
F3  750mA  [FUSE0603]
P3  Header 2  [HDR1X2]  (no BOM)
P4  Header 2  [HDR1X2]  (no BOM)
R25  0R  [RES0603]
R26  470R  [RES0603]
U3  NCP1117  [SOT-223 - 4con]

### Nets
GND: C4.1 C5.1 D5.1(cathode) P3.2 P4.2 U3.1(GND/ADJ)
VDD3V3: R25.2
VDD5V: C4.2 F3.2 R26.2 U3.3(VIN)
VDDUSB: D4.2(ANODE) P3.1 P4.1
NetC5_2: C5.2 R25.1 U3.2(VOUT)
NetD4_1: D4.1(cathode) F3.1
NetD5_2: D5.2(ANODE) R26.1

### Notes on the sheet
- POWER
- Design note:
  Expected max current consumption: 170mA (ESP12) + 26mA (CP2012) = 200mA
  Output from NCP1117: 3.3V 800mA
  Current limit: 500 mA?
  Max supply voltage: 20 V
  Voltage dropout: 1.2V@800mA
- POWER CONNS
- Desing note:
  Power supply pins for chaining modules together
- Title
- Size:
- Date:
- A3
- Number:
- Time:
- Revision:
- Sheet
- of
- File:
- (in symbol SDTitleBlock) Title:; Page Contents:; Revision:; Size:; DWG NO; Date:; Sheet; of

### Library data of the parts
C4 C5 = 10uF /16V: as C7 on sheet PAGE3-USB_TO_UART; Supplier 1: Farnell; Manufacturer: TDK; Manufacturer Part Number: CGA4J1X5R1C106K125AC; RoHS: YES; Stock 1: 8974; Pricing 1: 5=0.41, 50=0.146, 250=0.131, 500=0.12, 1000=0.103 (GBP); ComponentLink1URL: http://bcove.me/e1v54mtm; ComponentLink1Description: http://bcove.me/e1v54mtm; ComponentLink2URL: http://www.farnell.com/datasheets/1936565.pdf; ComponentLink2Description: http://www.farnell.com/datasheets/1936565.pdf; ComponentLink3URL: http://www.farnell.com/datasheets/1683658.pdf; ComponentLink3Description: http://www.farnell.com/datasheets/1683658.pdf; Supplier Part Number 1: 2210948RL
D4 = MBR120VLSFT3G: ON SEMICONDUCTOR - MBR120VLSFT3G - SCHOTTKY RECT, 1A, 20V, SOD123; Supplier 1: Farnell; Manufacturer: ON SEMICONDUCTOR; Manufacturer Part Number: MBR120VLSFT3G; RoHS: YES; Stock 1: 7030; Pricing 1: 1=0.335, 10=0.255, 100=0.125, 250=0.122, 500=0.101, 1000=0.079 (GBP); ComponentLink1URL: http://www.farnell.com/datasheets/2028665.pdf; ComponentLink1Description: http://www.farnell.com/datasheets/2028665.pdf; ComponentLink2URL: http://www.farnell.com/datasheets/2159241.pdf; ComponentLink2Description: http://www.farnell.com/datasheets/2159241.pdf; Supplier Part Number 1: 2533227
D5 = LED RED: as D1 on sheet PAGE2-ESP12_CORE; Supplier 1: Farnell; Manufacturer: BROADCOM LIMITED; Manufacturer Part Number: HSMS-C190; RoHS: YES; Stock 1: 7534; Pricing 1: 1=0.361, 10=0.256, 50=0.235, 100=0.106, 200=0.101 (GBP); LED Colour: Red; Bulb Size: -; Packaging: Cut Tape; Product Range: -; Automotive Qualification Standard: -; MSL: -; ComponentLink1URL: http://www.farnell.com/datasheets/313031.pdf; ComponentLink1Description: http://www.farnell.com/datasheets/313031.pdf; ComponentLink2URL: http://www.farnell.com/datasheets/1681524.pdf; ComponentLink2Description: http://www.farnell.com/datasheets/1681524.pdf; ComponentLink3URL: http://www.farnell.com/datasheets/2165483.pdf; ComponentLink3Description: http://www.farnell.com/datasheets/2165483.pdf; Supplier Part Number 1: 2497356
F3 = PTC FUSE 750mA: LITTELFUSE - 0603L035YR - RESETTABLE FUSE, PTC, 40A, 6V, 0605; Thermistor Mounting: SMD; Holding Current: 350; Tripping Current: 750; Voltage Rating: 6; Carrying Current Max: 40; Initial Resistance Max: 1; PTC Fuse Case Style: 0603 [1608 Metric]; Power Dissipation Pd: 0.5W<!--FANDB--><div class="features-and-benefits-container"><div class="features-and-benefits-description"><span class="features-benefits-value">The POLYFUSE 0603; Supplier 1: Farnell; Manufacturer: LITTELFUSE; Manufacturer Part Number: 0603L035YR; RoHS: YES; Stock 1: 2393; Pricing 1: 10=1.56, 100=1.22, 500=1.03, 1000=0.917, 2000=0.877, 4000=0.86, 20000=0.842, 40000=0.825 (GBP); Product Range: POLYFUSE 0603; Operating Temperature Min: -40; Operating Temperature Max: 85; Automotive Qualification Standard: -; Holding Current Max Ih: 350; Operating Voltage: 6; ComponentLink1URL: http://www.farnell.com/datasheets/611622.pdf; ComponentLink1Description: http://www.farnell.com/datasheets/611622.pdf; Supplier Part Number 1: 1832099
P3 P4 = Header 2: Header, 2-Pin; LatestRevisionDate: 17-Jul-2002; LatestRevisionNote: Re-released for DXP Platform.; Publisher: Altium Limited
R25 = 0R: as R5 on sheet PAGE2-ESP12_CORE; Supplier 1: Farnell; Manufacturer: BOURNS; Manufacturer Part Number: CR0603-J/-000ELF; RoHS: YES; Stock 1: 58200; Pricing 1: 10=0.0146, 250=0.0097, 1000=0.0073, 5000=0.0049, 12500=0.0042 (GBP); Resistance Tolerance: ± 5%; Packaging: Cut Tape; Resistor Element Material: Thick Film; Temperature Coefficient: -; Automotive Qualification Standard: -; MSL: MSL 1 - Unlimited; ComponentLink1URL: http://www.bourns.com/engineering/CHPREZTR/cr0603.stp; ComponentLink1Description: http://www.bourns.com/engineering/CHPREZTR/cr0603.stp; ComponentLink2URL: http://www.farnell.com/datasheets/2178762.pdf; ComponentLink2Description: http://www.farnell.com/datasheets/2178762.pdf; Supplier Part Number 1: 2008343
R26 = 470R: as R1 on sheet PAGE2-ESP12_CORE; Supplier 1: Farnell; Manufacturer: MULTICOMP; Manufacturer Part Number: MCMR06X471 JTL; RoHS: Y-EX; Stock 1: 3786; Pricing 1: 10=0.0089, 100=0.0076, 500=0.0063, 1000=0.0049, 2500=0.0033, 5000=0.0024, 25000=0.0016, 50000=0.0013 (GBP); ComponentLink1URL: http://www.farnell.com/datasheets/1716707.pdf; ComponentLink1Description: http://www.farnell.com/datasheets/1716707.pdf; Supplier Part Number 1: 2073513
U3 = NCP1117: NCP1117, NCV1117. 1.0 A Low-Dropout Positive  Fixed and Adjustable  Voltage Regulators